# EAGLE design Relaya_the second (EAGLE 9.1.2)
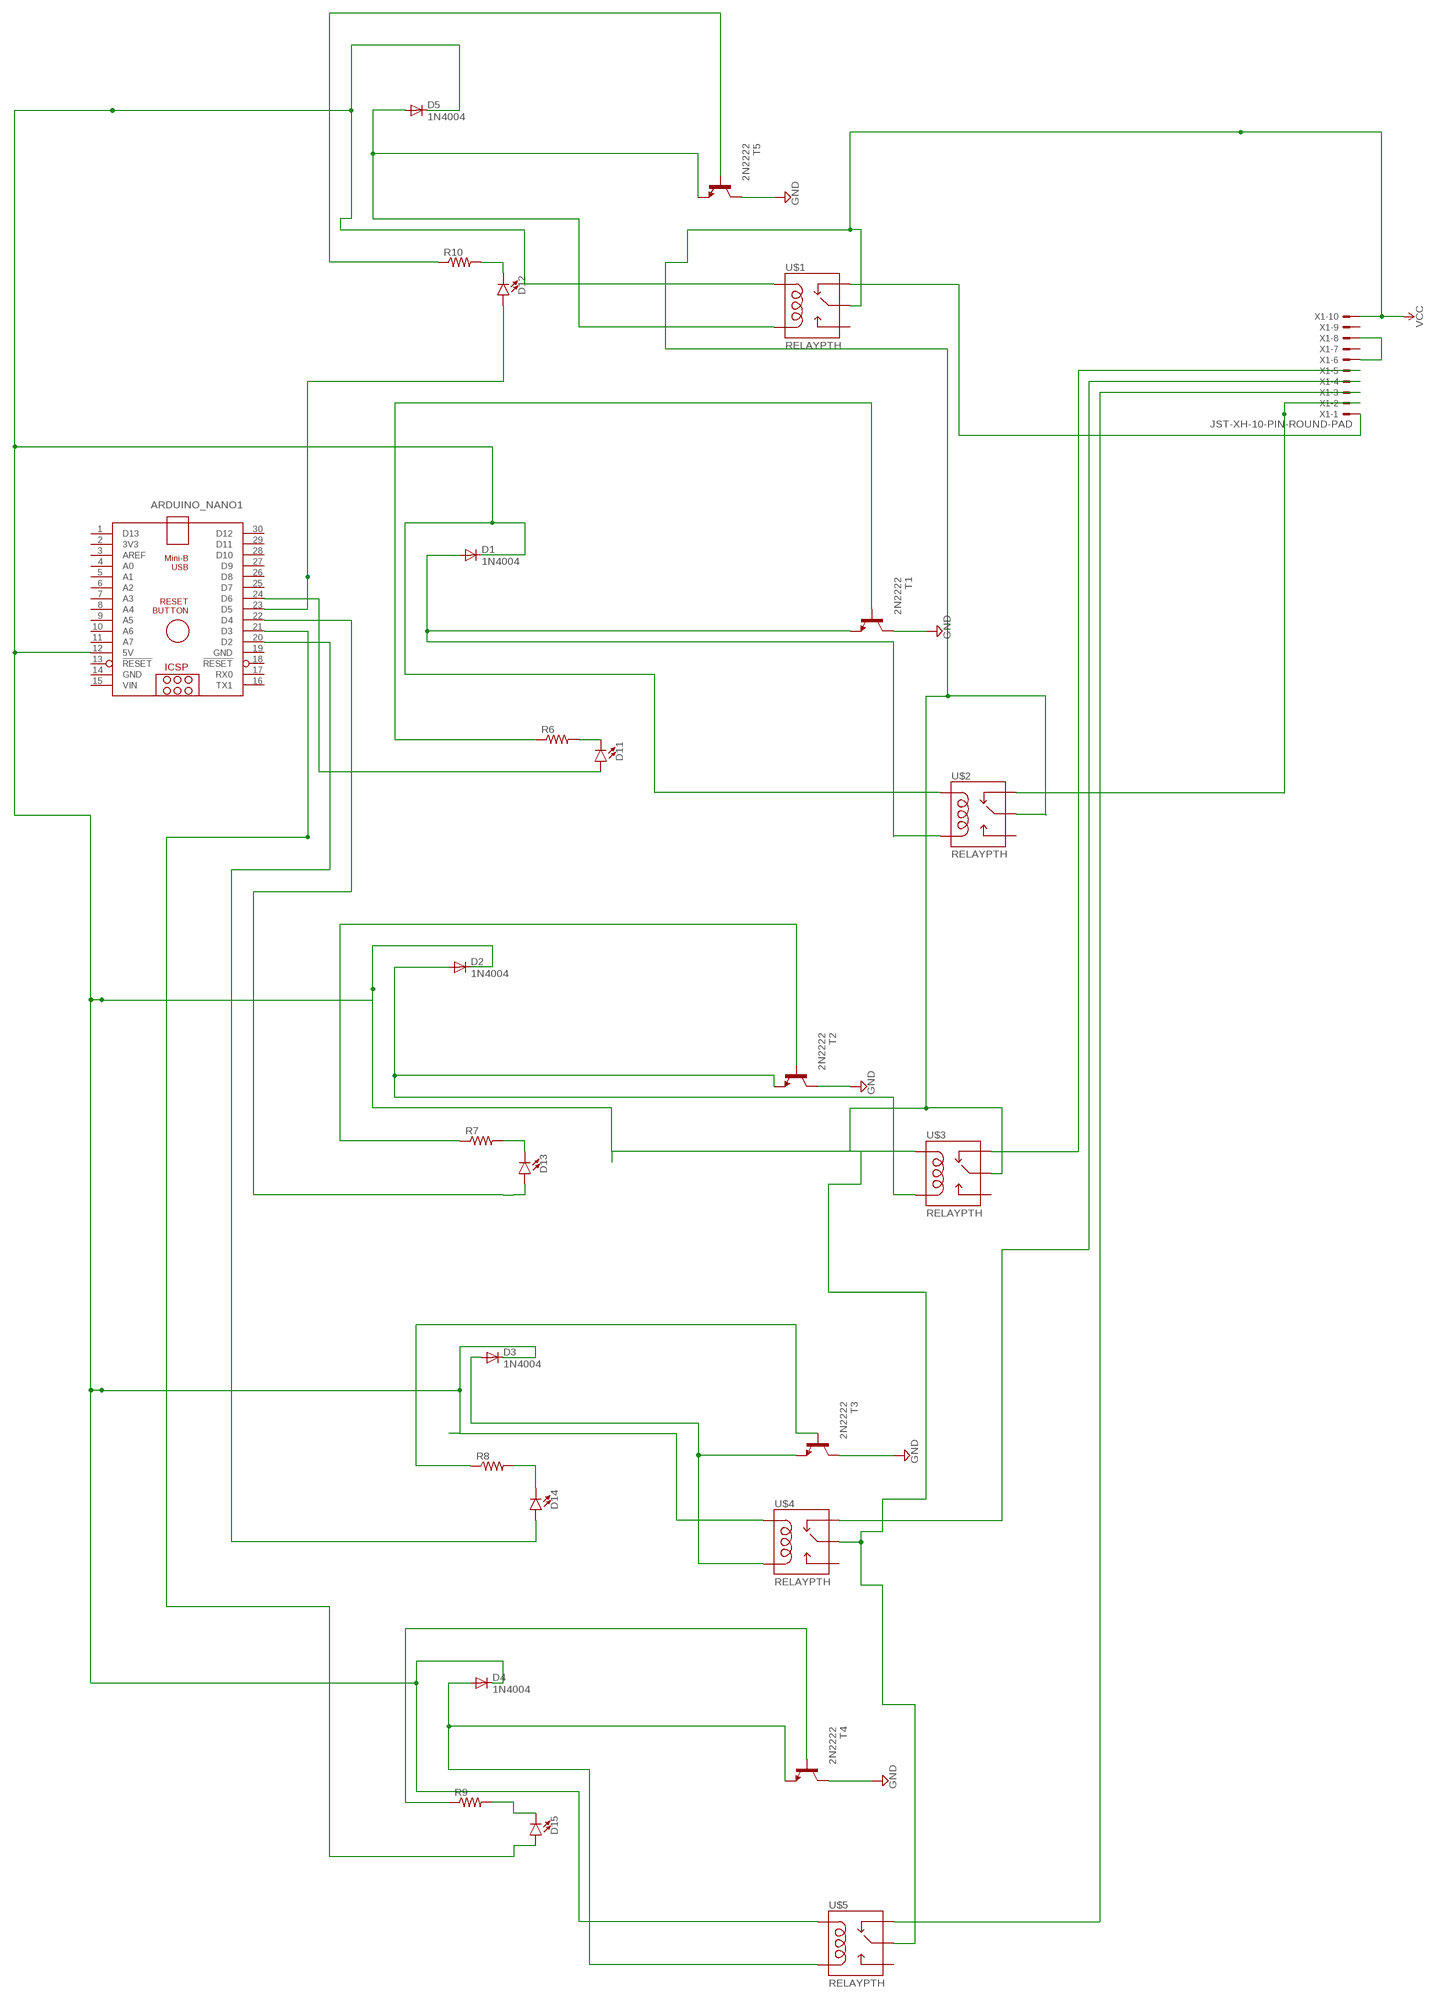
[diagram p0: schematic, sheet 1]

## Parts
ARDUINO_NANO1  ARDUINO_NANO  [ARDUINO_NANO]
D1  1N4004  [DO41-10]
D2  1N4004  [DO41-10]
D3  1N4004  [DO41-10]
D4  1N4004  [DO41-10]
D5  1N4004  [DO41-10]
D11  LED5MM  [LED_5MM]
D12  LED5MM  [LED_5MM]
D13  LED5MM  [LED_5MM]
D14  LED5MM  [LED_5MM]
D15  LED5MM  [LED_5MM]
R6  R-US_0207/10  [0207/10]
R7  R-US_0207/10  [0207/10]
R8  R-US_0207/10  [0207/10]
R9  R-US_0207/10  [0207/10]
R10  R-US_0207/10  [0207/10]
T1  2N2222  [TO92-EBC-OVAL]
T2  2N2222  [TO92-EBC-OVAL]
T3  2N2222  [TO92-EBC-OVAL]
T4  2N2222  [TO92-EBC-OVAL]
T5  2N2222  [TO92-EBC-OVAL]
U$1  RELAYPTH  [SRD-05VDC-SL-C]
U$2  RELAYPTH  [SRD-05VDC-SL-C]
U$3  RELAYPTH  [SRD-05VDC-SL-C]
U$4  RELAYPTH  [SRD-05VDC-SL-C]
U$5  RELAYPTH  [SRD-05VDC-SL-C]
X1  JST-XH-10-PIN-ROUND-PAD  [JST-XH-10-PACKAGE-ROUND-PAD]

## Nets
5V [Data]: ARDUINO_NANO1.12(5V) D1.C D2.C D3.C D4.C D5.C U$1.COIL1 U$2.COIL1 U$3.COIL1 U$4.COIL1 U$5.COIL1
GND [Power]: T1.C T2.C T3.C T4.C T5.C
N$1 [Data]: U$1.SWCLOSED(SWCLOSE) X1.1
N$2 [Data]: ARDUINO_NANO1.23(D5) D12.A
N$3 [Data]: R6.1 T1.B
N$4 [Data]: U$2.SWCLOSED(SWCLOSE) X1.2
N$5 [Data]: D1.A T1.E U$2.COIL0
N$6 [Data]: ARDUINO_NANO1.24(D6) D11.A
N$7 [Data]: D2.A T2.E U$3.COIL0
N$8 [Data]: R7.1 T2.B
N$9 [Data]: ARDUINO_NANO1.22(D4) D13.A
N$10 [Data]: U$3.SWCLOSED(SWCLOSE) X1.5
N$11 [Data]: D3.A T3.E U$4.COIL0
N$12 [Data]: R8.1 T3.B
N$13 [Data]: U$4.SWCLOSED(SWCLOSE) X1.4
N$14 [Data]: R10.1 T5.B
N$15: X1.6 X1.8
N$16 [Data]: D5.A T5.E U$1.COIL0
N$17 [Data]: R9.1 T4.B
N$18 [Data]: ARDUINO_NANO1.20(D2) D14.A
N$19 [Data]: D4.A T4.E U$5.COIL0
N$20 [Data]: U$5.SWCLOSED(SWCLOSE) X1.3
N$22 [Data]: ARDUINO_NANO1.21(D3) D15.A
N$23 [Data]: D12.K(C) R10.2
N$24 [Data]: D11.K(C) R6.2
N$25 [Data]: D14.K(C) R8.2
N$26 [Data]: D13.K(C) R7.2
N$27 [Data]: D15.K(C) R9.2
VCC [Power]: U$1.SWCOMMON U$2.SWCOMMON U$3.SWCOMMON U$4.SWCOMMON U$5.SWCOMMON X1.10
Unconnected: ARDUINO_NANO1.1(D13) ARDUINO_NANO1.2(3V3) ARDUINO_NANO1.3(AREF) ARDUINO_NANO1.4(A0) ARDUINO_NANO1.5(A1) ARDUINO_NANO1.6(A2) ARDUINO_NANO1.7(A3) ARDUINO_NANO1.8(A4) ARDUINO_NANO1.9(A5) ARDUINO_NANO1.10(A6) ARDUINO_NANO1.11(A7) ARDUINO_NANO1.13(!RESET) ARDUINO_NANO1.16(TX1) ARDUINO_NANO1.17(RX0) ARDUINO_NANO1.18(!RESET) ARDUINO_NANO1.25(D7) ARDUINO_NANO1.26(D8) ARDUINO_NANO1.27(D9) ARDUINO_NANO1.28(D10) ARDUINO_NANO1.29(D11) ARDUINO_NANO1.30(D12) U$1.SWOPEN U$2.SWOPEN U$3.SWOPEN U$4.SWOPEN U$5.SWOPEN X1.7 X1.9

## Power pins joined to a net without a drawn wire
GND: ARDUINO_NANO1.14(GND) ARDUINO_NANO1.19(GND)
VIN: ARDUINO_NANO1.15(VIN)

## Library data of the parts
ARDUINO_NANO1 = ArduinoNanoV30 GHIT:ARDUINO_NANO: Arduino Nano V3.0 Overview: The Arduino Nano is a small, complete, and breadboard-friendly board based on the ATmega328 (Arduino Nano 3.x) or ATmega168 (Arduino Nano 2.x). It has more or less the same functionality of the Arduino Duemilanove, but in a different package. It lacks only a DC power jack, and works with a Mini-B USB cable instead of a standard one. The Nano was designed and is being produced by Gravitech. Specifications: Microcontroller Atmel ATmega168 or ATmega328 Operating Voltage (logic level) 5 V Input Voltage (recommended) 7-12 V Input Voltage (limits) 6-20 V Digital I/O Pins 14 (of which 6 provide PWM output) Analog Input Pins 8 DC Current per I/O Pin 40 mA Flash Memory 16 KB (ATmega168) or 32 KB (ATmega328) of which 2 KB used by bootloader SRAM 1 KB (ATmega168) or 2 KB (ATmega328) EEPROM 512 bytes (ATmega168) or 1 KB (ATmega328) Clock Speed 16 MHz Dimensions 0.73" x 1.70" Length 45 mm Width 18 mm Weigth 5 g Power: The Arduino Nano can be powered via the Mini-B USB connection, 6-20V unregulated external power supply (pin 30), or 5V regulated external power supply (pin 27). The power source is automatically selected to the highest voltage source. Memory: The ATmega168 has 16 KB of flash memory for storing code (of which 2 KB is used for the bootloader); the ATmega328 has 32 KB, (also with 2 KB used for the bootloader). The ATmega168 has 1 KB of SRAM and 512 bytes of EEPROM (which can be read and written with the EEPROM library); the ATmega328 has 2 KB of SRAM and 1 KB of EEPROM. Input and Output: Each of the 14 digital pins on the Nano can be used as an input or output, using pinMode(), digitalWrite(), and digitalRead() functions. They operate at 5 volts. Each pin can provide or receive a maximum of 40 mA and has an internal pull-up resistor (disconnected by default) of 20-50 kOhms. In addition, some pins have specialized functions. Visit Arduino - ArduinoBoardNano <https://www.arduino.cc/en/Main/ArduinoBoardNano>
D1-D5 = adafruit:1N4004: DIODE General purpose 1N400x type rectifier (With bigger pads) http://www.ladyada.net/library/pcb/eaglelibrary.html
D11-D15 = SparkFun-LED:LED: LED (Generic) Standard schematic elements and footprints for 5mm, 3mm, 1206, and 0603 sized LEDs. Generic LEDs with no color specified.
R6-R10 = adafruit:R-US_: RESISTOR, American symbol
T1-T5 = adafruit:2N2222: NPN TRANSISTOR Big oval pads
U$1-U$5 = SRD-Relay:RELAY: SPDT relay (COM-00101)
X1 = JST XH Connectors GHII:JST-XH-10-PIN: JST XH Connector 2 Pin Wire to board connector. Pitch: 2,54 mm, (0.100") Number of pins: 10 Created by Rembrandt Electronics www.rembrandtelectronics.com

## Net classes
1 Power: width 0.762 mm, drill 0.762 mm, clearance 0.635 mm
2 Data: width 0.762 mm, drill 0.762 mm, clearance 0.635 mm

## Board
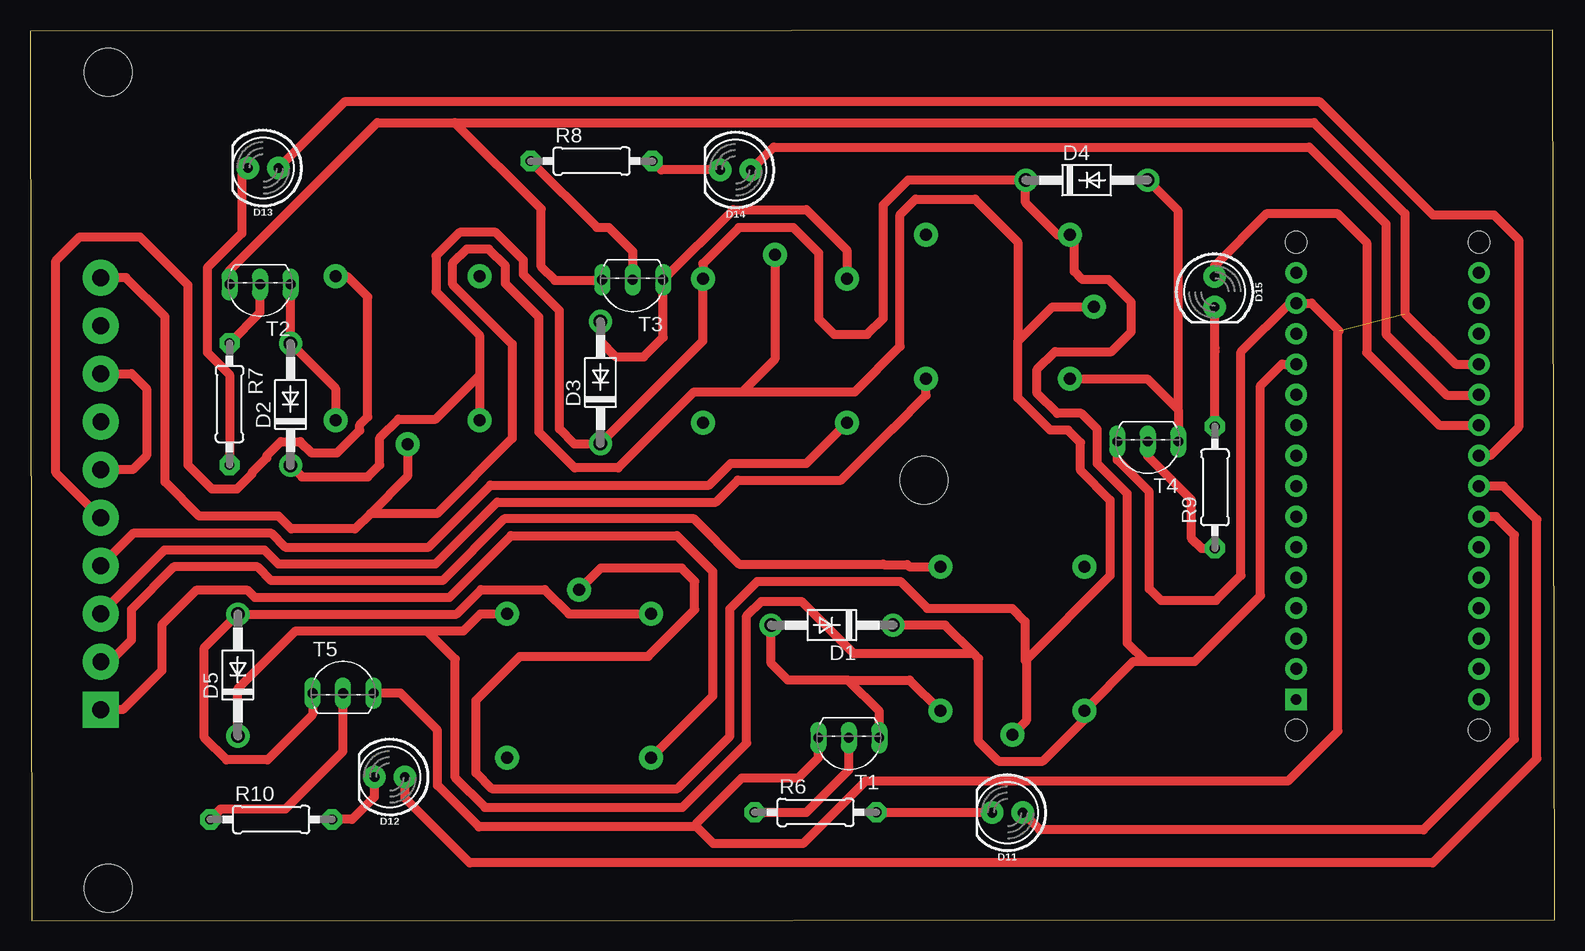
[diagram p1: board, top side]
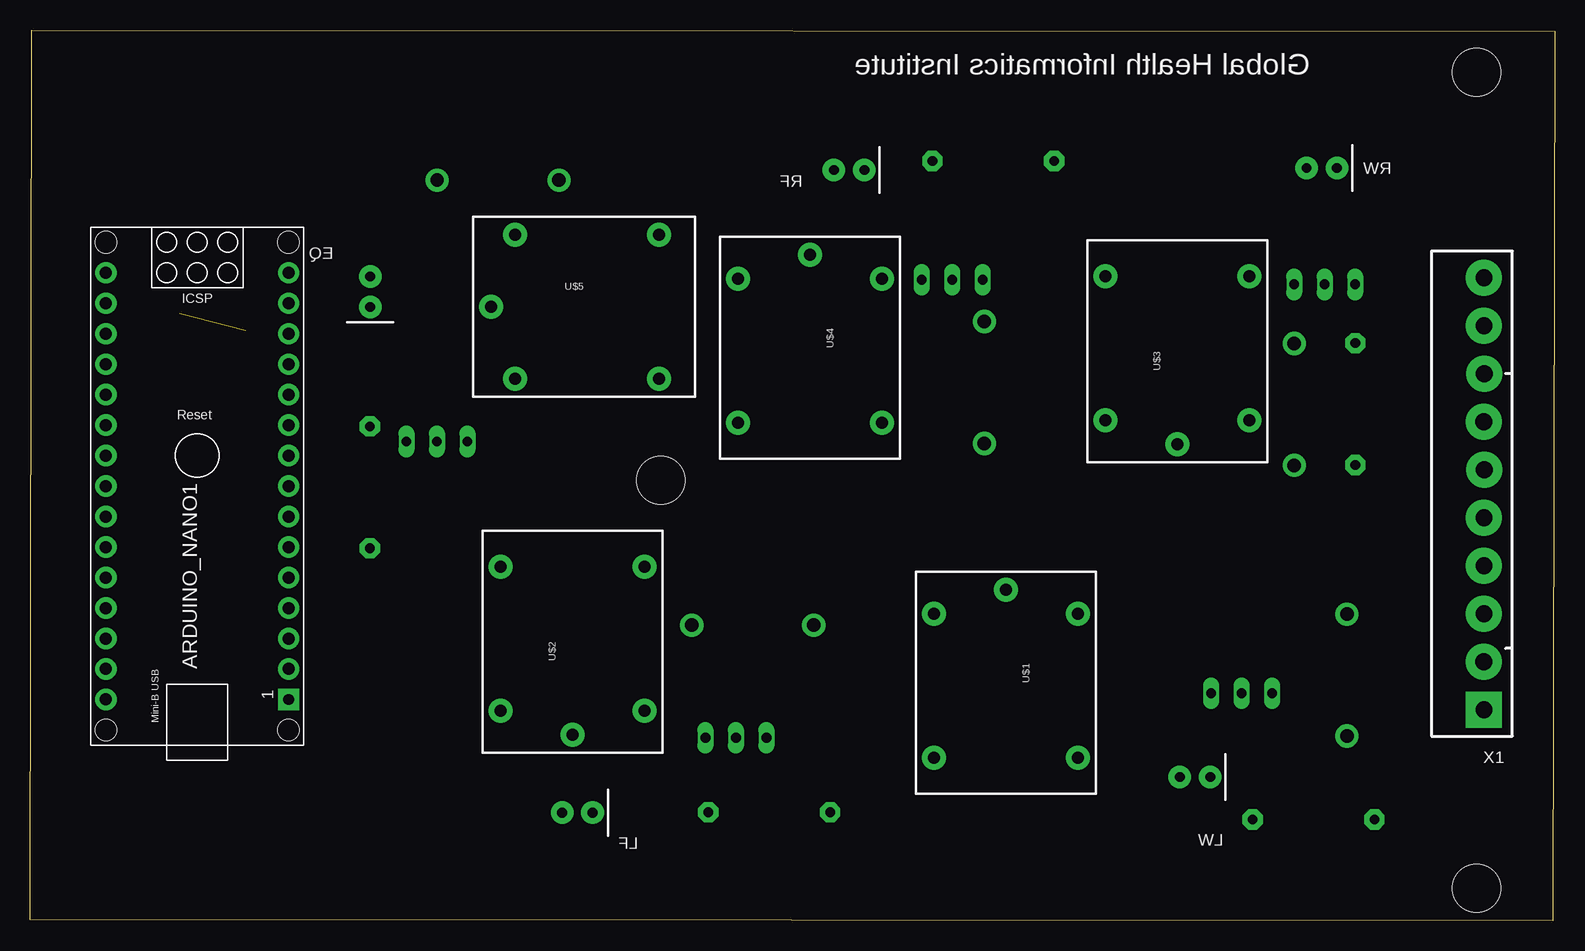
[diagram p2: board, bottom side, seen from below]

Size 127.11 x 74.25 mm. Coordinates in mm from the lower left corner, seen from the top.
Outline: 0.15,0 127.11,0.12 126.96,74.25 0,74.13 0.15,0
Copper layers (1*16): Top 0.035mm / dielectric 1.5mm / Bottom 0.035mm
Design rules "default": minimum track width 6mil, minimum drill 0.35mm, track to track 6mil, track to pad 6mil, pad to pad 6mil, via to via 6mil, smd to smd 6mil, copper to edge 40mil, drill to drill 6mil, minimum pad ring 10mil, minimum via ring 8mil, stop-mask expansion 4mil, vias tented up to drill 0mil, thermal gap 10mil
Holes 4 mm at 74.52,36.73 6.52,70.73 6.52,2.73

### Footprints (pad centres in the part's own frame; a part is rotated, then mirrored left to right if it is on the bottom)
ARDUINO_NANO = drill 0.9 pad 1.778 square: 1 -20.32,-7.62 | drill 1 pad 1.778: 2 -17.78,-7.62; 3 -15.24,-7.62; 4 -12.7,-7.62; 5 -10.16,-7.62; 6 -7.62,-7.62; 7 -5.08,-7.62; 8 -2.54,-7.62; 9 0,-7.62; 10 2.54,-7.62; 11 5.08,-7.62; 12 7.62,-7.62; 13 10.16,-7.62; 14 12.7,-7.62; 15 15.24,-7.62; 16 15.24,7.62; 17 12.7,7.62; 18 10.16,7.62; 19 7.62,7.62; 20 5.08,7.62; 21 2.54,7.62; 22 0,7.62; 23 -2.54,7.62; 24 -5.08,7.62; 25 -7.62,7.62; 26 -10.16,7.62; 27 -12.7,7.62; 28 -15.24,7.62; 29 -17.78,7.62; 30 -20.32,7.62 | hole 1.778: -22.86,-7.62; -22.86,7.62; 17.78,7.62; 17.78,-7.62
DO41-10 = drill 1.118 pad 1.93: A 5.08,0; C -5.08,0
LED_5MM = drill 0.813 pad 1.88: A -1.27,0; K 1.27,0
0207/10 = drill 0.813 pad 1.676 octagon: 1 -5.08,0; 2 5.08,0
TO92-EBC-OVAL = drill 0.813 long: B 0,-1.27; C 2.54,-1.27; E -2.54,-1.27
SRD-05VDC-SL-C = drill 1 pad 2: COIL0 -5.39,-6.12; COIL1 -5.39,5.88; SWCLOSED 6.61,-6.12; SWCOMMON -7.39,-0.12; SWOPEN 6.61,5.88
JST-XH-10-PACKAGE-ROUND-PAD = drill 1.4 pad 3 square: 1 -18.5,0 | drill 1.4 pad 3: 2 -14.5,0.01; 3 -10.5,0; 4 -6.5,0; 5 -2.5,0; 6 1.5,-0.01; 7 5.5,0.01; 8 9.5,-0.01; 9 13.5,0; 10 17.5,0

### Placement (x,y rotation side)
ARDUINO_NANO1  113.17,38.78 90 bottom
D1  66.86,24.65 180 top
D2  21.72,43.04 90 top
D3  47.56,44.87 90 top
D4  88.09,61.74 0 top
D5  17.33,20.49 90 top
D11  81.48,9.02 180 top
D12  29.99,11.99 180 top
D13  19.43,62.74 180 top
D14  58.82,62.58 180 top
D15  98.75,52.43 270 top
R6  65.49,9.05 0 top
R7  16.63,43.08 270 top
R8  46.81,63.33 0 top
R9  98.78,36.13 90 top
R10  20.11,8.46 0 top
T1  68.26,14 180 top
T2  19.18,51.78 180 top
T3  50.23,52.16 180 top
T4  93.18,38.69 180 top
T5  26.1,20.25 0 top
U$1  45.65,20.21 270 bottom
U$2  82,22.92 90 bottom
U$3  31.59,47.11 90 bottom
U$4  61.98,48.12 270 bottom
U$5  81.3,51.3 0 bottom
X1  5.9,36.11 90 bottom

### Tracks (layer width: path | path; a pad name or v marks a point on that pad's centre or on a via)
5V
  Top 0.762: D5.C 17.33,19.35 22.16,24.17 33.08,24.17 | 93.01,21.63 91.48,23.16 91.48,35.61 88.97,38.12 88.97,40.96 87.64,42.29 85.64,42.29 83.96,43.97 83.96,45.96 85.45,47.45 90.15,47.45 91.81,49.1 91.81,51.55 89.92,53.44 87.75,53.44 87.05,54.13 87.05,56.82 U$5.COIL1 85.66,57.18 82.99,59.85 82.99,61.76 | ARDUINO_NANO1.12 104.36,46.4 102.57,44.6 102.57,27.11 97.09,21.63 93.01,21.63 | D3.C 47.53,39.77 45.37,39.77 44.13,41.01 44.13,50.87 41.14,53.85 41.14,55.08 38.82,57.39 35.82,57.39 33.85,55.42 33.85,52.45 37.47,48.83 37.47,45.46 | D3.C 47.87,39.79 | 33.08,24.17 35.44,21.81 35.44,11.95 37.92,9.47 54.39,9.47 59.75,14.83 59.75,25.42 60.96,26.63 64.3,26.63 68.64,22.29 78.64,22.29 | D1.C 76.28,24.65 78.64,22.29 | 78.64,22.29 79.08,21.85 79.08,14.99 80.74,13.33 84.44,13.33 87.88,16.77 U$2.COIL1 91.98,21.63 93.01,21.63 | 82.99,61.76 82.84,61.91 | 82.99,61.76 73.22,61.76 71.13,59.67 71.13,50.22 69.79,48.87 67.03,48.87 65.73,50.17 65.73,55.67 63.62,57.78 59.1,57.78 56.1,54.78 U$4.COIL1 56.1,48.34 D3.C | 82.99,61.76 D4.C | 33.08,24.17 36.13,24.17 37.55,25.6 U$1.COIL1 | 37.47,45.46 U$3.COIL1 | 37.47,45.46 33.82,41.81 30.71,41.81 29.15,40.25 29.15,38 28.15,37 22.68,37 D2.C
GND  (1 unrouted)
  Top 0.762: 55.58,7.83 37.43,7.83 33.96,11.3 33.96,15.89 30.88,18.98 T5.C | T3.C 47.64,53.38 43.76,53.38 42.61,54.53 42.61,59.33 35.41,66.53 | T2.C 16.64,54.22 28.96,66.53 35.41,66.53 | ARDUINO_NANO1.19 118.84,46.4 114.62,50.62 114.62,58.94 107.03,66.53 35.41,66.53 | 55.58,7.83 56.96,6.45 64.42,6.45 69.62,11.65 104.85,11.65 109.03,15.82 109.03,49.08 109.12,49.17 106.82,51.48 ARDUINO_NANO1.14 105.02,51.48 100.96,47.42 100.96,28.8 98.87,26.71 94.28,26.71 93.31,27.68 93.31,35.75 90.64,38.42 T4.C | T1.C 65.72,13.59 64.04,11.91 59.33,11.91 55.58,8.16 55.58,7.83
N$1
  Top 0.762: X1.1 7.72,17.61 10.98,20.87 10.98,24.68 13.85,27.55 18.15,27.55 18.73,26.97 34.97,26.97 40.1,32.1 53.93,32.1 56.9,29.13 56.9,25.46 56.9,25.27 56.9,18.73 U$1.SWCLOSED
N$2
  Top 0.762: ARDUINO_NANO1.23 122.82,36.24 125.61,33.44 125.61,13.52 116.93,4.84 36.66,4.84 31.26,10.23 D12.A
N$3
  Top 0.762: R6.1 64.72,9.05 68.26,12.59 T1.B
N$4
  Top 0.762: X1.2 6.64,21.61 8.44,23.41 8.44,25.95 12,29.51 18.97,29.51 20.12,28.36 34.39,28.36 39.52,33.5 55.36,33.5 59.12,29.73 71.1,29.73 71.15,29.69 73.13,29.69 73.29,29.53 U$2.SWCLOSED
N$5
  Top 0.762: 68.18,20.08 70.8,17.46 T1.E | D1.A 61.78,21.47 63.18,20.08 68.18,20.08 | 68.18,20.08 73.33,20.08 U$2.COIL0
N$6
  Top 0.762: ARDUINO_NANO1.24 122.2,33.7 123.75,32.15 123.75,15.18 116.15,7.59 84.18,7.59 D11.A
N$7
  Top 0.762: T2.E D2.A 25.47,44.37 U$3.COIL0
N$8
  Top 0.762: R7.1 19.18,50.71 T2.B
N$9
  Top 0.762: ARDUINO_NANO1.22 121.72,38.78 124.1,41.16 124.1,56.77 122.02,58.84 116.94,58.84 107.53,68.25 26.21,68.25 D13.A
N$10
  Top 0.762: X1.5 2.15,37.36 2.15,55 4.15,57 9.15,57 13.15,53 13.15,38 15.15,36 17.25,36 18.48,37.23 18.48,37.33 19.74,38.59 19.74,38.78 20.9,39.95 22.54,39.95 23.48,39 25.6,39 27.49,40.88 27.49,41.34 28.15,42 28.15,52 26.43,53.72 U$3.SWCLOSED
N$11
  Top 0.762: D3.A 47.56,48.3 48.83,47.03 51.12,47.03 51.15,47 52.77,48.62 T3.E 58.63,59.28 64.71,59.28 68.1,55.9 U$4.COIL0
N$12
  Top 0.762: T3.B 50.23,55.8 48.24,57.8 47.26,57.8 R8.1
N$13
  Top 0.762: X1.4 8.59,32.3 20.13,32.3 21.28,31.16 33.23,31.16 38.39,36.31 56.62,36.31 58.43,38.13 64.72,38.13 U$4.SWCLOSED
N$14
  Top 0.762: T5.B 26.1,14.15 21.3,9.35 15.92,9.35 R10.1
N$15
  Top 0.762: X1.8 8.46,45.61 9.71,44.37 9.71,38.78 8.54,37.61 X1.6
N$16
  Top 0.762: T5.E 23.56,17.2 19.79,13.43 16.39,13.43 14.54,15.28 14.54,22.77 D5.A 35.55,25.57 37.59,27.62 42.9,27.62 44.93,25.58 46.6,25.58 46.62,25.6 U$1.COIL0
N$17
  Top 0.762: R9.1 97.68,31.05 96.78,31.95 96.78,35.13 93.18,38.73 T4.B
N$18
  Top 0.762: 113.03,57.68 113.05,57.65 | ARDUINO_NANO1.20 120.76,43.83 118.1,43.83 113.03,48.9 113.03,57.68 | 113.03,57.68 113.03,58.09 106.63,64.48 61.99,64.48 D14.A
N$19
  Top 0.762: 95.73,42.59 T4.E | D4.A 95.73,59.18 95.73,42.59 | U$5.COIL0 93.14,45.18 95.73,42.59
N$20
  Top 0.762: X1.3 11.19,30.9 19.55,30.9 20.7,29.76 33.81,29.76 38.95,34.9 57.18,34.9 59.01,36.73 67.62,36.73 71.87,40.97 71.96,41.07 74.69,43.8 U$5.SWCLOSED
N$22
  Top 0.762: ARDUINO_NANO1.21 117.47,41.32 111.43,47.36 111.43,56.52 109.02,58.92 103.06,58.92 98.75,54.61 D15.A
N$23
  Top 0.762: R10.2 26.84,8.46 28.72,10.34 D12.K
N$24
  Top 0.762: R6.2 79.38,9.05 | 79.38,9.05 80.06,9.05 | 79.38,9.05 79.41,9.02 D11.K
N$25
  Top 0.762: D14.K 52.63,62.58 R8.2
N$26
  Top 0.762: D13.K 17.65,62.23 17.65,57.3 14.78,54.43 14.78,47.39 16.63,45.53 R7.2
N$27
  Top 0.762: R9.2 98.78,47.46 | 98.78,47.46 98.78,47.75 | 98.78,47.46 98.75,47.49 D15.K
VCC
  Top 0.762: 59.38,44.1 68.76,44.1 72.54,47.88 72.54,58.85 73.83,60.14 78.78,60.14 82.35,56.57 82.35,48.3 | 28.38,33.95 33.93,33.95 40.2,40.22 40.2,48.07 35.25,53.02 35.25,54.84 36.4,55.99 38.25,55.99 39.64,54.6 39.64,53.11 42.42,50.33 42.42,40.73 45.4,37.76 49.04,37.76 55.37,44.1 59.38,44.1 | X1.10 7.99,53.61 11.27,50.33 11.27,36.59 14.11,33.74 20.71,33.74 21.78,32.67 27.1,32.67 28.38,33.95 | 83.05,21.79 90.04,28.77 90.04,35.07 87.57,37.54 87.57,39.85 86.53,40.89 85.06,40.89 82.35,43.6 82.35,48.3 | 83.05,21.79 82.96,21.69 82.96,24.95 81.86,26.05 74.79,26.05 72.55,28.29 60.64,28.29 58.35,26 58.35,15.41 53.97,11.03 38.48,11.03 37.17,12.34 37.17,18.39 40.84,22.06 51.53,22.06 55.41,25.94 55.41,28.31 54.32,29.4 47.57,29.4 U$1.SWCOMMON | U$5.SWCOMMON 85.23,51.18 82.35,48.3 | U$4.SWCOMMON 62.1,46.82 59.38,44.1 | U$3.SWCOMMON 31.47,37.04 28.38,33.95 | 83.05,21.79 83.05,16.7 U$2.SWCOMMON

### Text on the board
bNames: Global Health Informatics Institute
_bNames: RW | RF | EQ | LW | LF